# Altium schematic sheet LVDS.SchDoc
size 420 x 297 mm; SheetNumber: 18; SheetTotal: 23
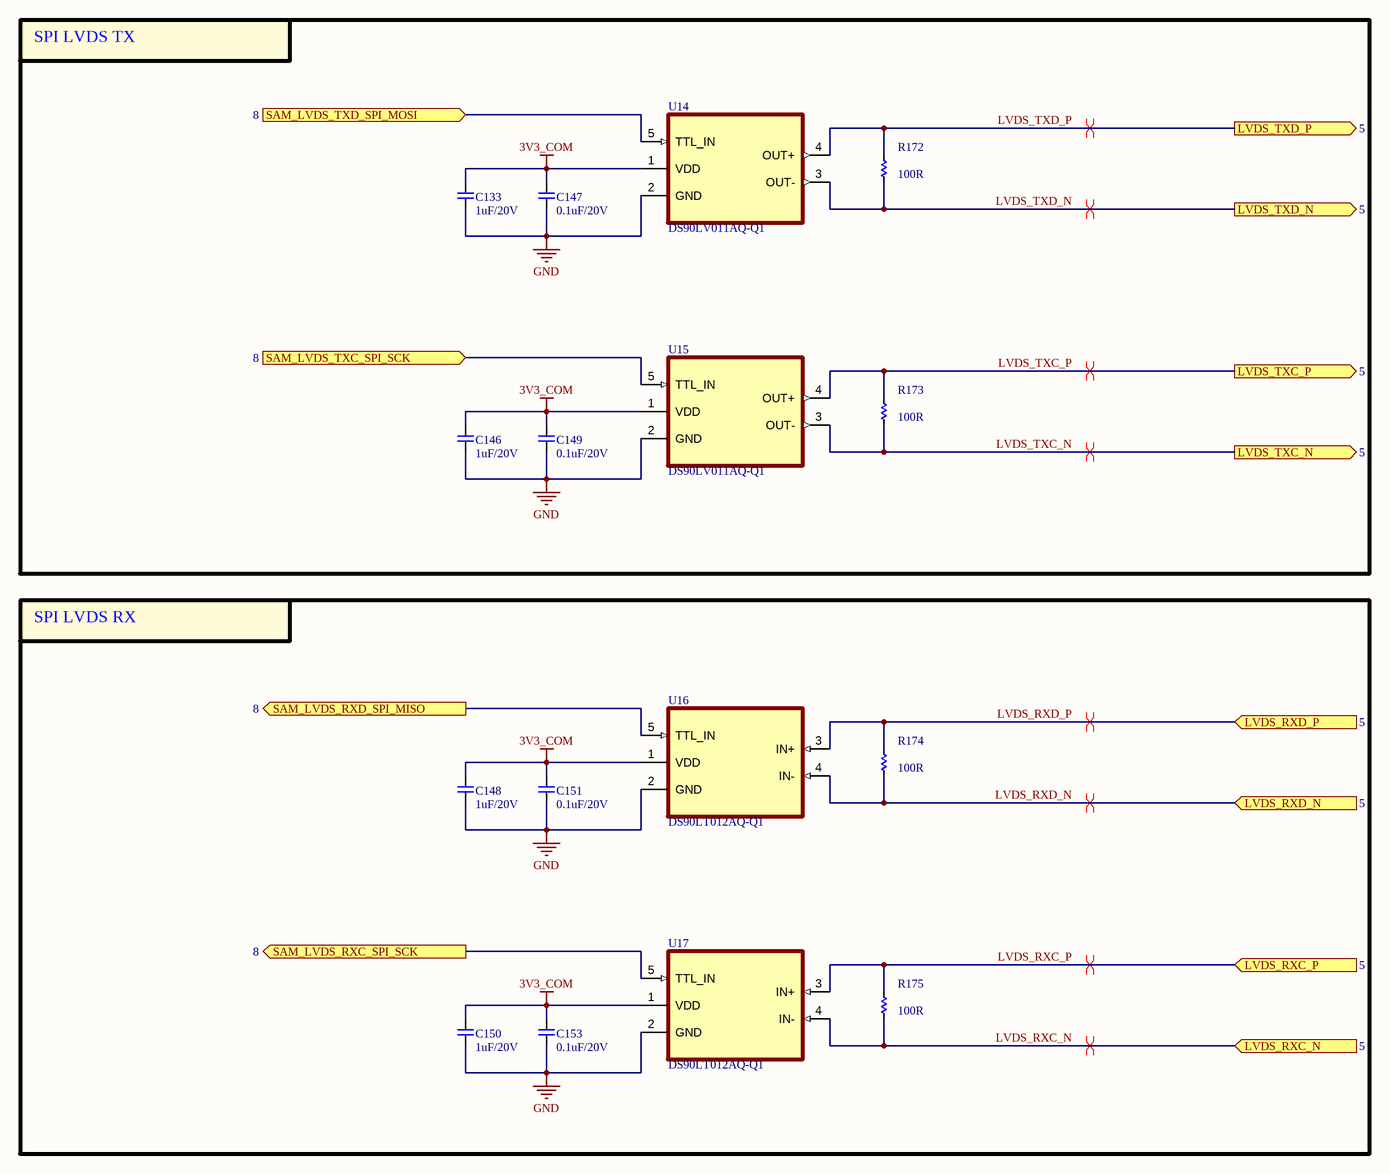
[diagram p0: LVDS.SchDoc]

## Parts
C133  1uF/20V  [CAP_C_1005X50_L]
C146  1uF/20V  [CAP_C_1005X50_L]
C147  0.1uF/20V  [CAP_C_1005X50_L]
C148  1uF/20V  [CAP_C_1005X50_L]
C149  0.1uF/20V  [CAP_C_1005X50_L]
C150  1uF/20V  [CAP_C_1005X50_L]
C151  0.1uF/20V  [CAP_C_1005X50_L]
C153  0.1uF/20V  [CAP_C_1005X50_L]
R172  100R  [RES_C_1005x30_L]
R173  100R  [RES_C_1005x30_L]
R174  100R  [RES_C_1005x30_L]
R175  100R  [RES_C_1005x30_L]
U14  DS90LV011AQ-Q1  [DS90LV011AQ-Q1]
U15  DS90LV011AQ-Q1  [DS90LV011AQ-Q1]
U16  DS90LT012AQ-Q1  [DS90LV011AQ-Q1]
U17  DS90LT012AQ-Q1  [DS90LV011AQ-Q1]

## Blocks framed on the sheet
SPI LVDS TX: C133 C146 C147 C149 R172 R173 U14 U15
SPI LVDS RX: C148 C150 C151 C153 R174 R175 U16 U17

## Ports
LVDS_RXC_N (in, see 5), LVDS_RXC_P (in, see 5), LVDS_RXD_N (in, see 5), LVDS_RXD_P (in, see 5), LVDS_TXC_N (out, see 5), LVDS_TXC_P (out, see 5), LVDS_TXD_N (out, see 5), LVDS_TXD_P (out, see 5), SAM_LVDS_RXC_SPI_SCK (out, see 8), SAM_LVDS_RXD_SPI_MISO (out, see 8), SAM_LVDS_TXC_SPI_SCK (in, see 8), SAM_LVDS_TXD_SPI_MOSI (in, see 8)

## Nets
3V3_COM: C133.2 C146.2 C147.2 C148.2 C149.2 C150.2 C151.2 C153.2 U14.1(VDD) U15.1(VDD) U16.1(VDD) U17.1(VDD)
GND: C133.1 C146.1 C147.1 C148.1 C149.1 C150.1 C151.1 C153.1 U14.2(GND) U15.2(GND) U16.2(GND) U17.2(GND)
LVDS_RXC_N: R175.2 U17.4(IN-) ; port LVDS_RXC_N
LVDS_RXC_P: R175.1 U17.3(IN+) ; port LVDS_RXC_P
LVDS_RXD_N: R174.2 U16.4(IN-) ; port LVDS_RXD_N
LVDS_RXD_P: R174.1 U16.3(IN+) ; port LVDS_RXD_P
LVDS_TXC_N: R173.2 U15.3(OUT-) ; port LVDS_TXC_N
LVDS_TXC_P: R173.1 U15.4(OUT+) ; port LVDS_TXC_P
LVDS_TXD_N: R172.2 U14.3(OUT-) ; port LVDS_TXD_N
LVDS_TXD_P: R172.1 U14.4(OUT+) ; port LVDS_TXD_P
SAM_LVDS_RXC_SPI_SCK: U17.5(TTL_IN) ; port SAM_LVDS_RXC_SPI_SCK
SAM_LVDS_RXD_SPI_MISO: U16.5(TTL_IN) ; port SAM_LVDS_RXD_SPI_MISO
SAM_LVDS_TXC_SPI_SCK: U15.5(TTL_IN) ; port SAM_LVDS_TXC_SPI_SCK
SAM_LVDS_TXD_SPI_MOSI: U14.5(TTL_IN) ; port SAM_LVDS_TXD_SPI_MOSI

## Layout directives
differential pair: LVDS_RXC_N, LVDS_RXC_P, LVDS_RXD_N, LVDS_RXD_P, LVDS_TXC_N, LVDS_TXC_P, LVDS_TXD_N, LVDS_TXD_P

## Notes on the sheet
- Project:
- BEE-1012
- Sub-system:
- SATELLITE_EXP_CONTROLLER
- Design by:
- SANG HUYNH
- BAO BUI
- Sheet title:
- Sheet
- A3
- of
- Checked by:
- Approved by:
- VU PHAM
- Revision:
- Document No:
- Size:
- Date:

## Library data of the parts
C133 C146-C151 C153 = _CAP_C_2: CAP CHIP
R172-R175 = _RES_B_2: RES
U14 U15 = DS90LV011AQ-Q1: Automotive LVDS Differential Driver
U16 U17 = DS90LT012AQ-Q1: Automotive LVDS Differential Line Receiver